# EAGLE design Luxeon Rebel Controller Board (EAGLE 6.4)
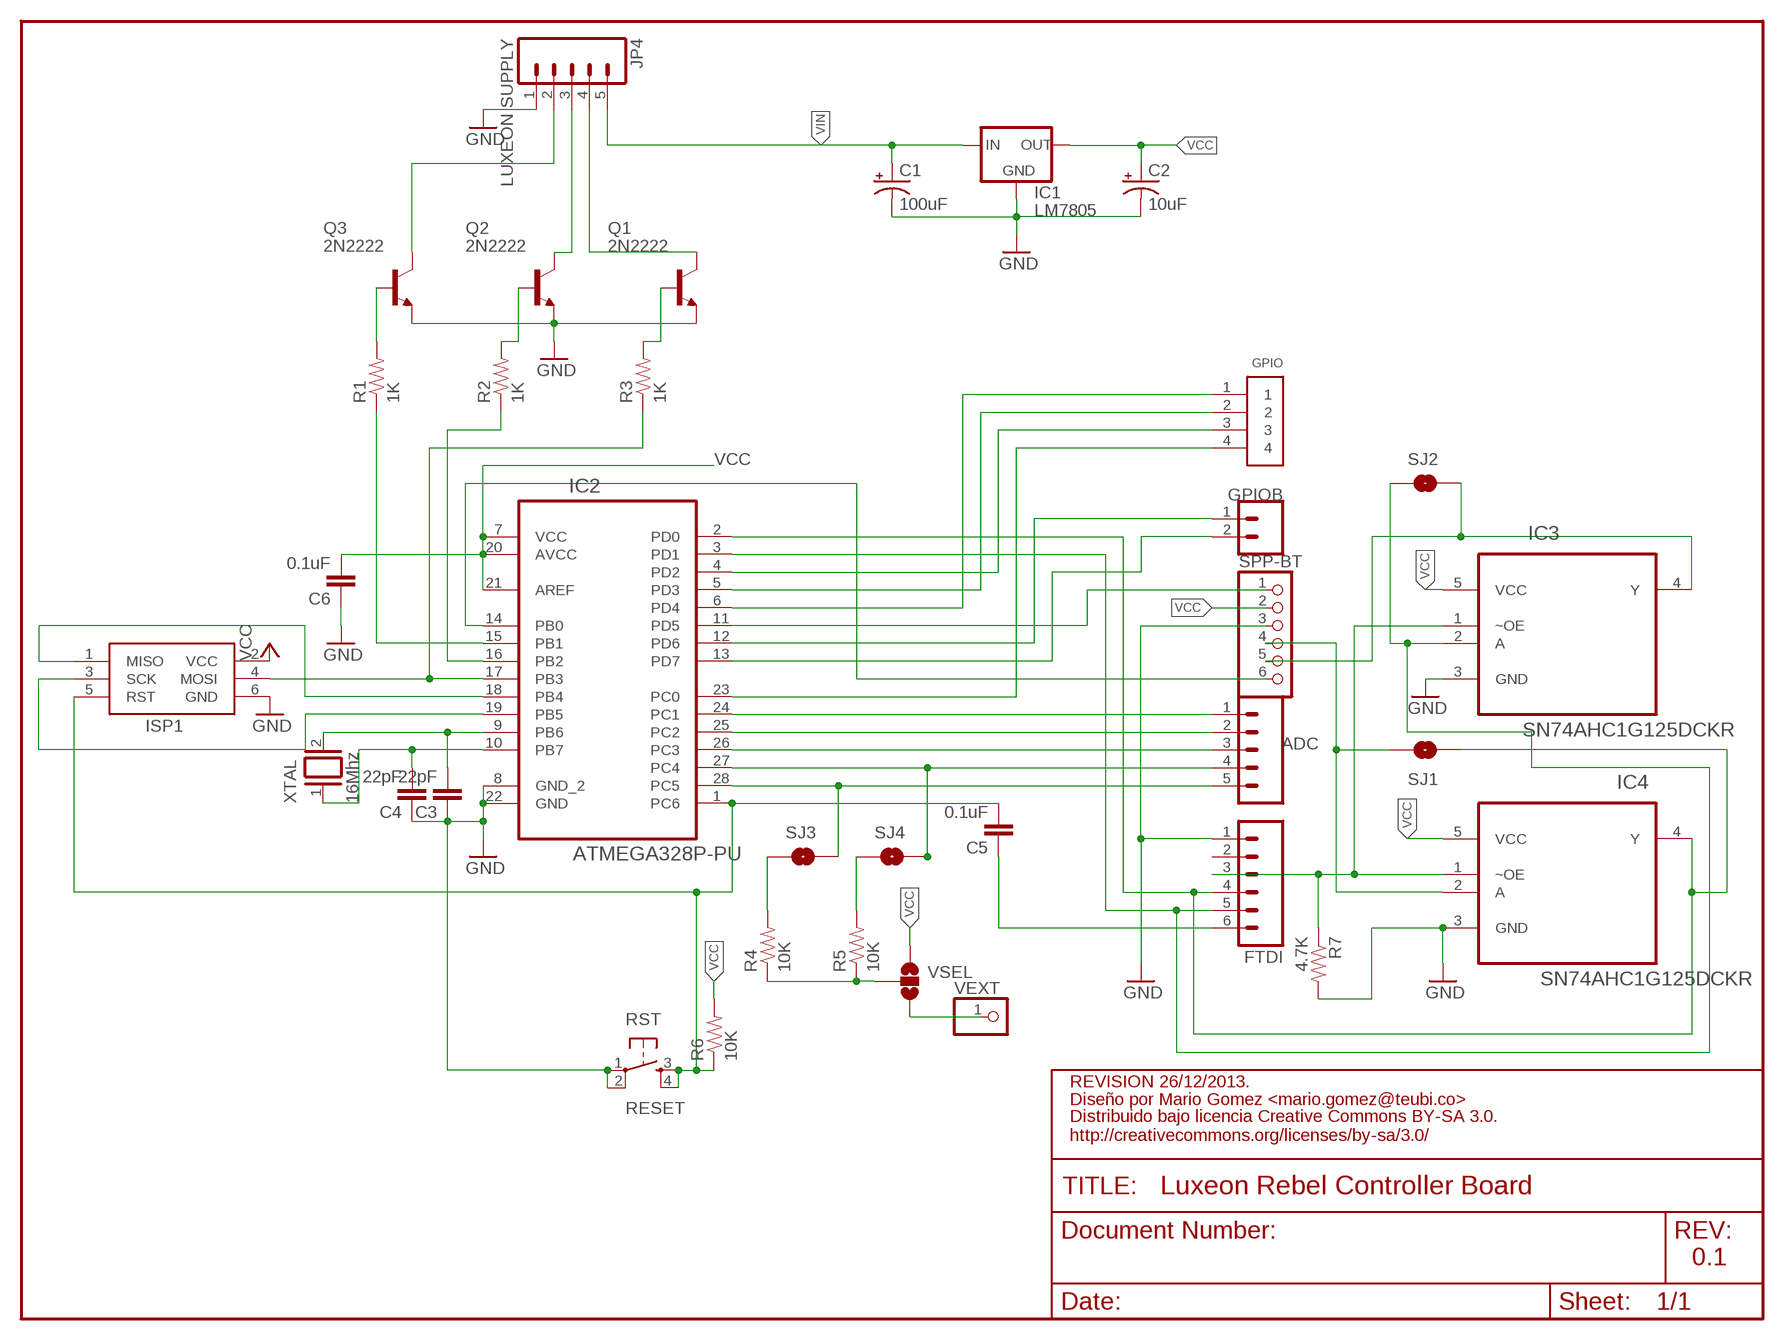
[diagram p0: schematic, sheet 1]

## Parts
ADC  M05PTH  [1X05]
C1  100uF  CAP_POLPTH1  [CPOL-RADIAL-100UF-25V]
C2  10uF  CAP_POLPTH2  [CPOL-RADIAL-10UF-25V]
C3  22pF  CAPPTH  [CAP-PTH-SMALL]
C4  22pF  CAPPTH  [CAP-PTH-SMALL]
C5  0.1uF  CAPPTH  [CAP-PTH-SMALL]
C6  0.1uF  CAPPTH  [CAP-PTH-SMALL]
FTDI  M06SIP  [1X06]
GPIO  1X4-BIG  [1X04-BIG]
GPIOB  M02PTH  [1X02]
IC1  LM7805  V_REG_78XXSIDE  [78XXL]
IC2  ATMEGA328P-PU  [DIP254P762X457-28]
IC3  SN74AHC1G125DCKR  [SOT65P210X110-5N]
IC4  SN74AHC1G125DCKR  [SOT65P210X110-5N]
ISP1  AVRISP-6  [AVRISP]
JP4  LUXEON SUPPLY  M05PTH_LONGPADS  [1X05_LONGPADS]
Q1  2N2222  [TO92-EBC-OVAL]
Q2  2N2222  [TO92-EBC-OVAL]
Q3  2N2222  [TO92-EBC-OVAL]
R1  1K  RESISTORAXIAL-0.3  [AXIAL-0.3]
R2  1K  RESISTORAXIAL-0.3  [AXIAL-0.3]
R3  1K  RESISTORAXIAL-0.3  [AXIAL-0.3]
R4  10K  RESISTORAXIAL-0.3  [AXIAL-0.3]
R5  10K  RESISTORAXIAL-0.3  [AXIAL-0.3]
R6  10K  RESISTORAXIAL-0.3  [AXIAL-0.3]
R7  4.7K  RESISTOR0603-RES  [0603-RES]
RST  RESET  TAC_SWITCHPTH  [TACTILE-PTH]
SJ1  SOLDERJUMPERNC  [SJ_2S]
SJ2  SOLDERJUMPERNC  [SJ_2S]
SJ3  SOLDERJUMPERTRACE  [SJ_2S-TRACE]
SJ4  SOLDERJUMPERTRACE  [SJ_2S-TRACE]
SPP-BT  PINHD-1X6  [1X06]
VEXT  PINHD-1X1  [1X01]
VSEL  SOLDERJUMPER_2WAY-OLDS  [SJ_3]
XTAL  16Mhz  XTAL/S  [QS]

## Nets
GND: C1.2(-) C2.2(-) C3.1 C4.1 C6.1 FTDI.1 IC1.GND IC2.8(GND_2) IC2.22(GND) IC3.3(GND) IC4.3(GND) ISP1.6(GND) JP4.1 Q1.E Q2.E Q3.E R7.2 RST.1 RST.2 SPP-BT.3
N$1: JP4.2 Q3.C
N$2: JP4.3 Q2.C
N$3: JP4.4 Q1.C
N$5: IC2.15(PB1) R1.P$1
N$6: IC2.16(PB2) R2.P$1
N$7: Q3.B R1.P$2
N$8: Q2.B R2.P$2
N$9: Q1.B R3.P$2
N$10: IC2.17(PB3) ISP1.4(MOSI) R3.P$1
N$12: C3.2 IC2.9(PB6) XTAL.2
N$13: IC2.18(PB4) ISP1.1(MISO)
N$14: ADC.5 IC2.28(PC5) SJ3.2
N$15: ADC.4 IC2.27(PC4) SJ4.2
N$16: IC4.2(A) SJ1.1 SPP-BT.4
N$17: C5.1 FTDI.6
N$18: FTDI.4 IC2.2(PD0) IC4.4(Y) SJ1.2
N$19: FTDI.3 IC3.1(~OE) IC4.1(~OE) R7.1
N$20: IC2.19(PB5) ISP1.3(SCK)
N$21: C4.2 IC2.10(PB7) XTAL.1
N$22: R4.P$2 SJ3.1
N$23: C5.2 IC2.1(PC6) ISP1.5(RST) R6.P$1 RST.3 RST.4
N$24: IC2.11(PD5) SPP-BT.1
N$25: IC2.14(PB0) SPP-BT.6
N$26: IC3.4(Y) SJ2.2 SPP-BT.5
N$27: R5.P$2 SJ4.1
N$28: GPIOB.2 IC2.13(PD7)
N$29: GPIOB.1 IC2.12(PD6)
N$30: ADC.3 IC2.26(PC3)
N$31: ADC.2 IC2.25(PC2)
N$32: ADC.1 IC2.24(PC1)
N$33: R4.P$1 R5.P$1 VSEL.2
N$34: VEXT.1 VSEL.3
N_PC0: GPIO.4 IC2.23(PC0)
N_PD1: FTDI.5 IC2.3(PD1) IC3.2(A) SJ2.1
N_PD2: GPIO.3 IC2.4(PD2)
N_PD3: GPIO.2 IC2.5(PD3)
N_PD4: GPIO.1 IC2.6(PD4)
VCC: C2.1(+) C6.2 IC1.OUT IC2.7(VCC) IC2.20(AVCC) IC2.21(AREF) IC3.5(VCC) IC4.5(VCC) ISP1.2(VCC) R6.P$2 SPP-BT.2 VSEL.1
VIN: C1.1(+) IC1.IN JP4.5
Unconnected: FTDI.2

## Notes on the sheet
- REVISION 26/12/2013.
- Diseño por Mario Gomez <mario.gomez@teubi.co>
- Distribuido bajo licencia Creative Commons BY-SA 3.0.
  http://creativecommons.org/licenses/by-sa/3.0/
- 0.1

## Library data of the parts
ADC = SparkFun-Connectors:M05: Header 5 Standard 5-pin 0.1" header. Use with straight break away headers (SKU : PRT-00116), right angle break away headers (PRT-00553), swiss pins (PRT-00743), machine pins (PRT-00117), and female headers (PRT-00115). Molex polarized connector foot print use with SKU : PRT-08230 with associated crimp pins and housings.
C1 C2 = SparkFun-Capacitors:CAP_POL: Capacitor Polarized These are standard SMD and PTH capacitors. Normally 10uF, 47uF, and 100uF in electrolytic and tantalum varieties. Always verify the external diameter of the through hole cap, it varies with capacity, voltage, and manufacturer. The EIA devices should be standard.
C3-C6 = SparkFun-Passives:CAP: Capacitor Standard 0603 ceramic capacitor, and 0.1" leaded capacitor.
FTDI = SparkFun-Connectors:M06: Header 6 Standard 6-pin 0.1" header. Use with straight break away headers (SKU : PRT-00116), right angle break away headers (PRT-00553), swiss pins (PRT-00743), machine pins (PRT-00117), and female headers (PRT-00115). Molex polarized connector foot print use with SKU : PRT-08094 with associated crimp pins and housings. NOTES ON THE VARIANTS LOCK and LOCK_LONGPADS... This footprint was designed to help hold the alignment of a through-hole component (i.e. 6-pin header) while soldering it into place. You may notice that each hole has been shifted either up or down by 0.005 of an inch from it's more standard position (which is a perfectly straight line). This slight alteration caused the pins (the squares in the middle) to touch the edges of the holes. Because they are alternating, it causes a "brace" to hold the component in place. 0.005 has proven to be the perfect amount of "off-center" position when using our standard breakaway headers. Although looks a little odd when you look at the bare footprint, once you have a header in there, the alteration is very hard to notice. Also,if you push a header all the way into place, it is covered up entirely on the bottom side. This idea of altering the position of holes to aid alignment will be further integrated into the Sparkfun Library for other footprints. It can help hold any component with 3 or more connection pins.
GPIO = adafruit:1X4: 4-pin connector
GPIOB = SparkFun-Connectors:M02: Standard 2-pin 0.1" header. Use with - straight break away headers ( PRT-00116) - right angle break away headers (PRT-00553) - swiss pins (PRT-00743) - machine pins (PRT-00117) - female headers (PRT-00115) Molex polarized connector foot print use with: PRT-08233 with associated crimp pins and housings. 2.54_SCREWTERM for use with PRT-10571. 3.5mm Screw Terminal footprints for PRT-08084 5mm Screw Terminal footprints for use with PRT-08433
IC1 = SparkFun-PowerIC:V_REG_78XX: Voltage Regulator Standard 7805 5V regulator. IGO (Input Ground Output). Spark Fun Electronics SKU : COM-00107
IC2 = Atmel_By_element14_Batch_1:ATMEGA328P-PU: 8-bit Microcontroller with In-System Programmable Flash; MPN: ATMEGA328P-PU; OC_FARNELL: 1715487; OC_NEWARK: 15R0268; PACKAGE: PDIP-28; SUPPLIER: Atmel
IC3 IC4 = NewArk-Downloads:SN74AHC1G125DCKR: Single Bus Buffer Gate With 3-State Output; MPN: SN74AHC1G125DCKR; OC_FARNELL: 1287409; OC_NEWARK: 76C1732; PACKAGE: SC70-5; SUPPLIER: Texas Instruments
ISP1 = adafruit:AVRISP: AVR ISP HEADER Standard 6 pin header for AVR programming
JP4 = SparkFun:M05: Header 5 Standard 5-pin 0.1" header. Use with straight break away headers (SKU : PRT-00116), right angle break away headers (PRT-00553), swiss pins (PRT-00743), machine pins (PRT-00117), and female headers (PRT-00115). Molex polarized connector foot print use with SKU : PRT-08230 with associated crimp pins and housings.
Q1-Q3 = adafruit:2N2222: NPN TRANSISTOR Big oval pads
R1-R7 = SparkFun-Passives:RESISTOR: Resistor Basic schematic elements and footprints for 0603, 1206, and PTH resistors.
RST = SparkFun-Electromechanical:TAC_SWITCH: Momentary Switch Button commonly used for reset or general input. Spark Fun Electronics SKU : COM-00097 SMT- SWCH-08247
SJ1-SJ4 = SparkFun-Passives:SOLDERJUMPER: Solder Jumper Standard SMD solder jumper. Used to automate production. Two varients : Normally Open and Normally Closed are the same, but have different paste layers. NC will have a large amount of paste and should jumper during reflow.
SPP-BT = adafruit:PINHD-1X6: PIN HEADER
VEXT = pinhead:PINHD-1X1: PIN HEADER
VSEL = SparkFun-Passives:SOLDERJUMPER_2WAY-OLD: Solder Jumper 2 way solder jumper
XTAL = special:XTAL/S: CRYSTAL

## Board
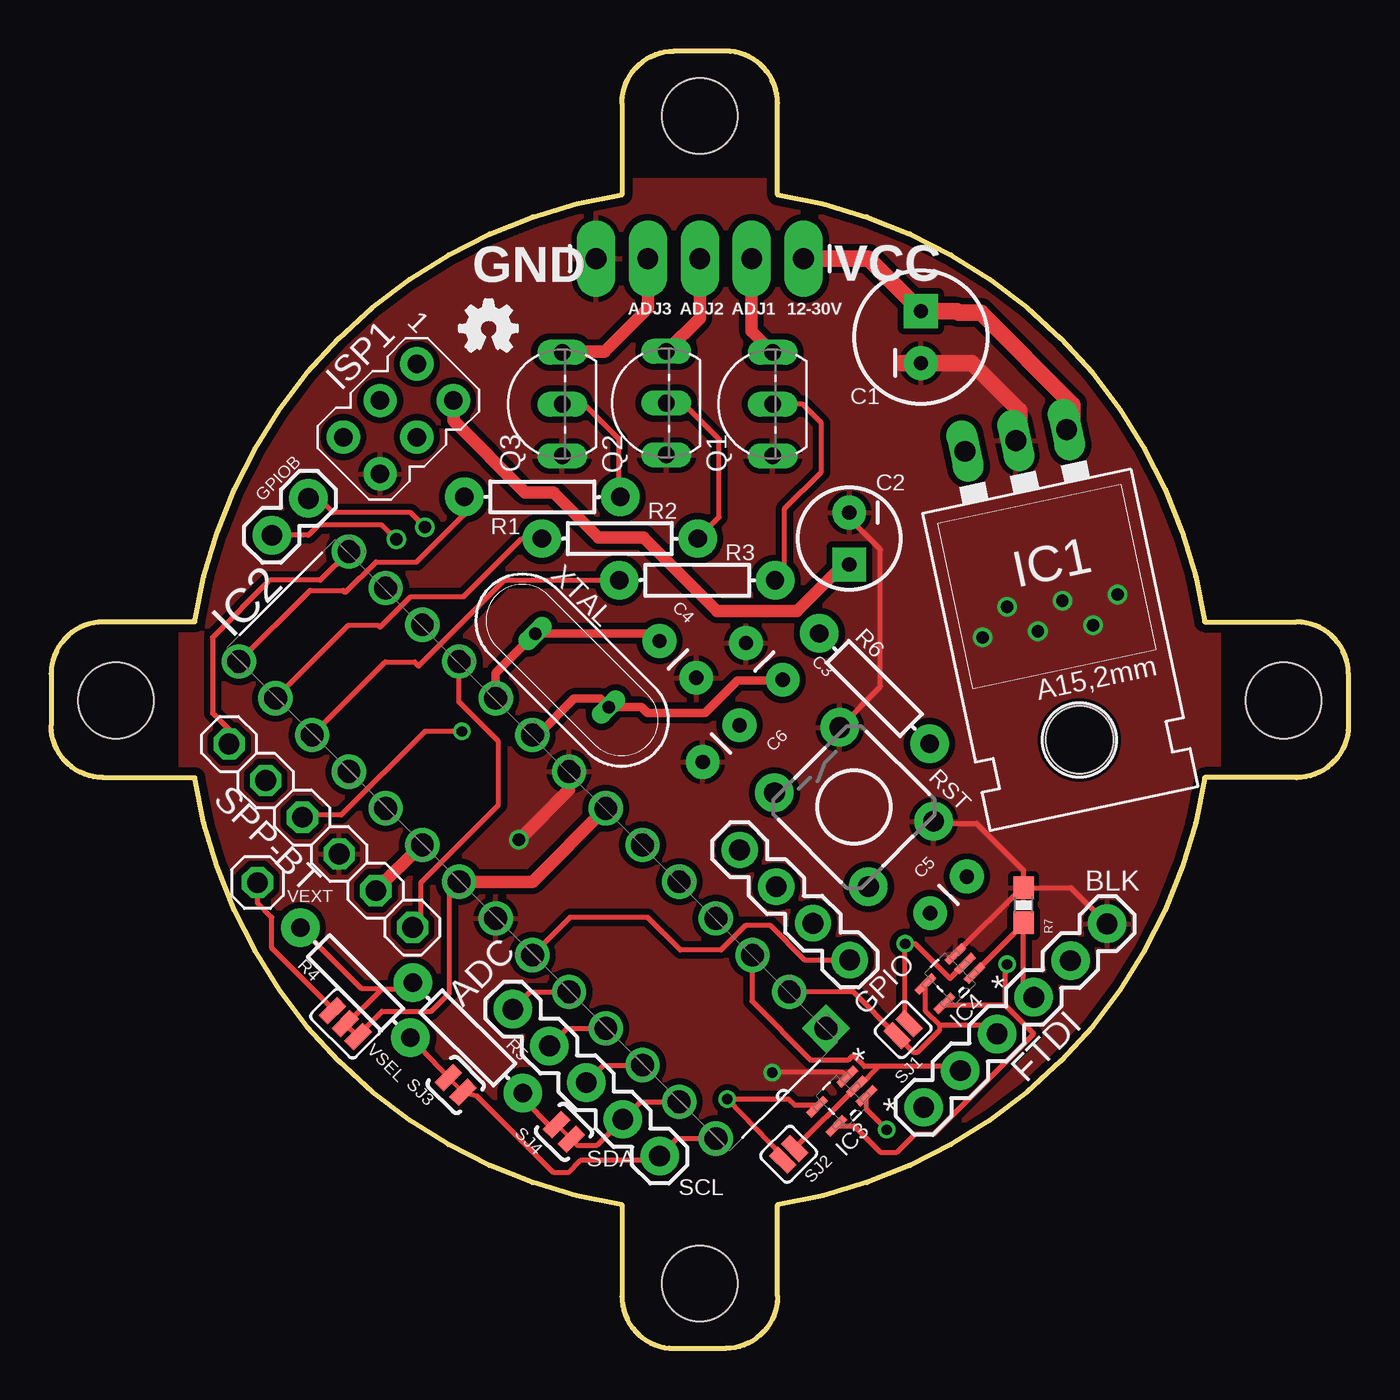
[diagram p1: board, top side]
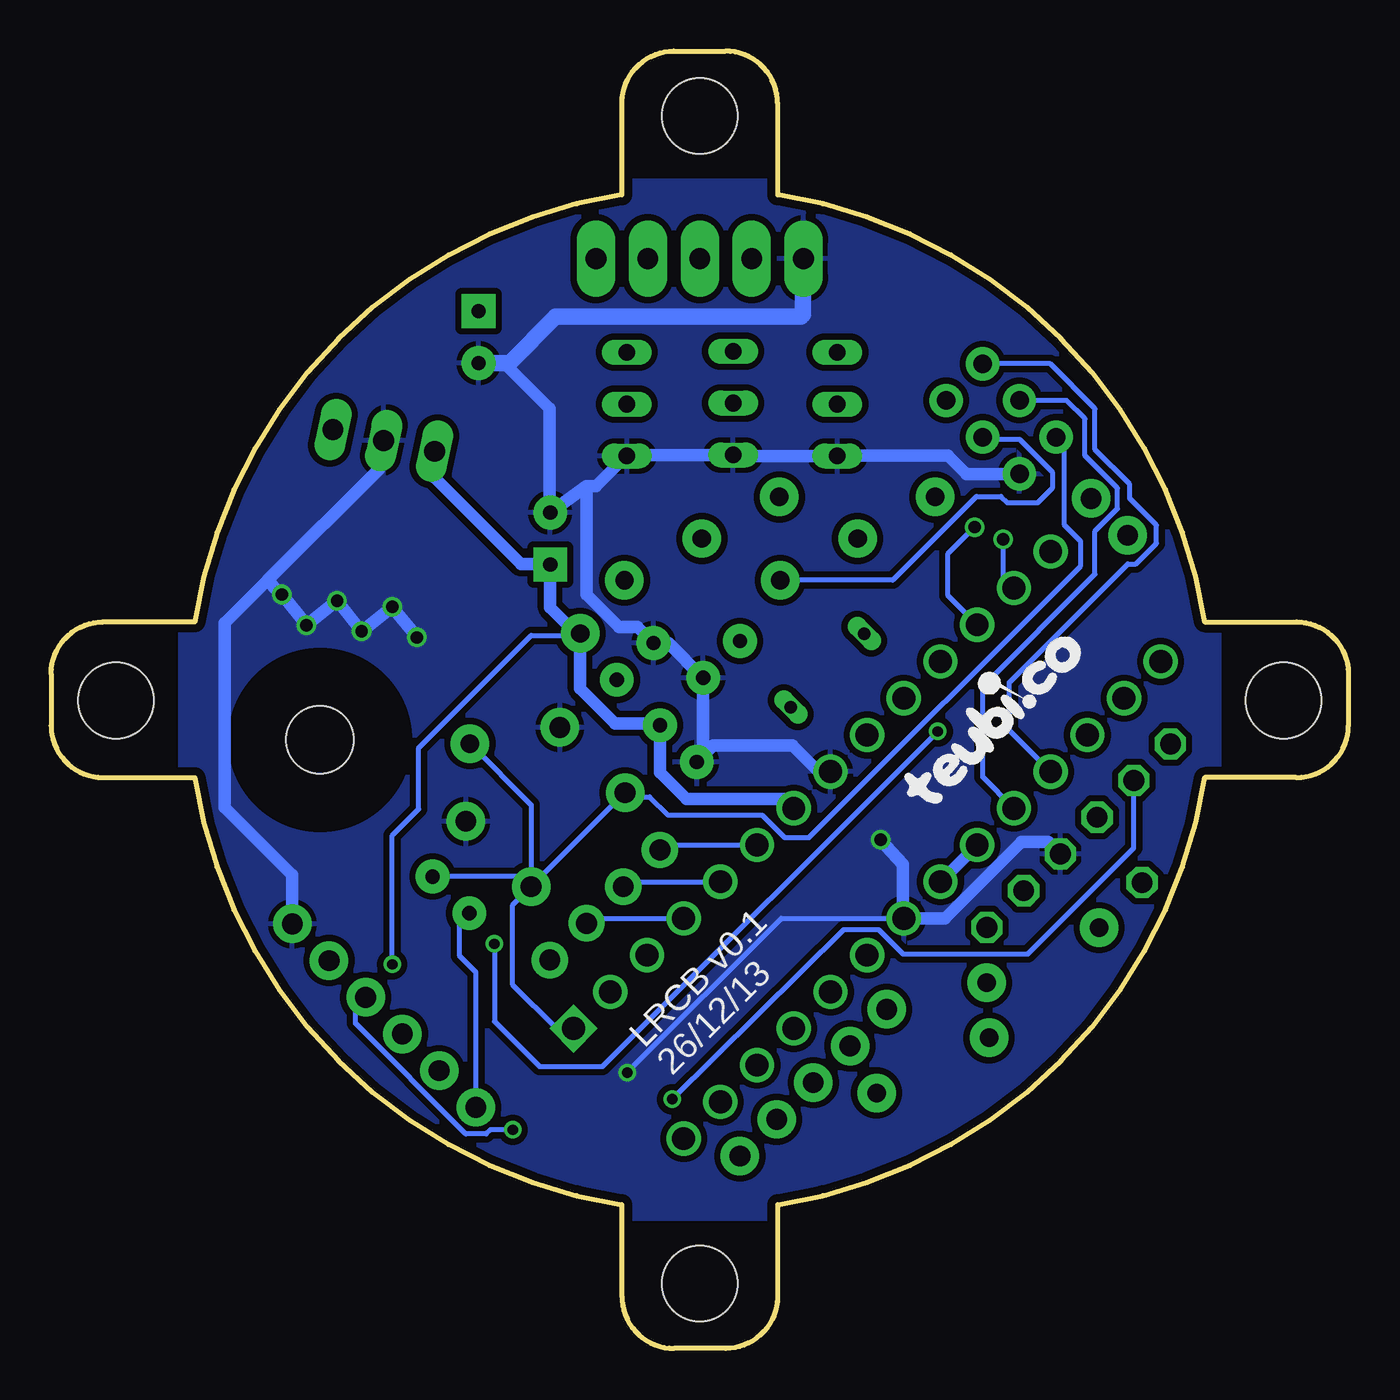
[diagram p2: board, bottom side, seen from below]

Size 63.5 x 63.5 mm. Coordinates in mm from the lower left corner, seen from the top.
Outline: 35.56,56.46 35.56,60.96 arc90 33.02,63.5 30.48,63.5 arc90 27.94,60.96 27.94,56.46 arc72 7.04,35.56 2.54,35.56 arc90 0,33.02 0,30.48 arc90 2.54,27.94 7.04,27.94 arc72 27.94,7.04 27.94,2.54 arc90 30.48,0 33.02,0 arc90 35.56,2.54 35.56,7.04 arc72 56.46,27.94 60.96,27.94 arc90 63.5,30.48 63.5,33.02 arc90 60.96,35.56 56.46,35.56 arc72 35.56,56.46
Copper layers (1*16): Top 0.0356mm / dielectric 1.5011mm / Bottom 0.0356mm
Design rules "LaenPCBOrder": minimum track width 6mil, minimum drill 13mil, track to track 6mil, track to pad 6mil, pad to pad 6mil, via to via 6mil, smd to smd 6mil, copper to edge 15mil, drill to drill 6mil, minimum pad ring 7mil, minimum via ring 7mil, stop-mask expansion 3mil, vias tented up to drill 0mil, thermal gap 10mil
Holes 3.7 mm at 31.75,60.33 60.33,31.71 3.17,31.71 31.75,3.17

### Footprints (pad centres in the part's own frame; a part is rotated, then mirrored left to right if it is on the bottom)
1X05 = drill 1.016 pad 1.88: 1 0,0; 2 2.54,0; 3 5.08,0; 4 7.62,0; 5 10.16,0
CPOL-RADIAL-100UF-25V = drill 0.7 pad 1.651 square: 1 1.27,0 | drill 0.7 pad 1.651: 2 -1.27,0
CPOL-RADIAL-10UF-25V = drill 0.7 pad 1.651 square: 1 1.27,0 | drill 0.7 pad 1.651: 2 -1.27,0
CAP-PTH-SMALL = drill 0.7 pad 1.651: 1 0,0; 2 2.54,0
1X06 = drill 1.016 pad 1.88: 1 0,0; 2 2.54,0; 3 5.08,0; 4 7.62,0; 5 10.16,0; 6 12.7,0
1X04-BIG = drill 1.016 pad 1.778: 1 0,0; 2 2.54,0; 3 5.08,0; 4 7.62,0
1X02 = drill 1.016 pad 1.88: 1 0,0; 2 2.54,0
78XXL = drill 1.016 long: GND 0,-3.81; IN -2.54,-3.81; OUT 2.54,-3.81 | hole 3.302: 0,11.176
DIP254P762X457-28 = drill 1.118 square: 1 -7.62,33.02 | drill 1.118: 2 -7.62,30.48; 3 -7.62,27.94; 4 -7.62,25.4; 5 -7.62,22.86; 6 -7.62,20.32; 7 -7.62,17.78; 8 -7.62,15.24; 9 -7.62,12.7; 10 -7.62,10.16; 11 -7.62,7.62; 12 -7.62,5.08; 13 -7.62,2.54; 14 -7.62,0; 15 0,0; 16 0,2.54; 17 0,5.08; 18 0,7.62; 19 0,10.16; 20 0,12.7; 21 0,15.24; 22 0,17.78; 23 0,20.32; 24 0,22.86; 25 0,25.4; 26 0,27.94; 27 0,30.48; 28 0,33.02
SOT65P210X110-5N = smd 1.168 x 0.356: 1 -1.041,0.66; 2 -1.041,0; 3 -1.041,-0.66; 4 1.041,-0.66; 5 1.041,0.66
AVRISP = drill 0.9 pad 1.626: 1 -1.27,2.54; 2 1.27,2.54; 3 -1.27,0; 4 1.27,0; 5 -1.27,-2.54; 6 1.27,-2.54
1X05_LONGPADS = drill 1.016 pad 1.88 long: 1 0,0; 2 2.54,0; 3 5.08,0; 4 7.62,0; 5 10.16,0
TO92-EBC-OVAL = drill 0.813 long: B 0,-1.27; C 2.54,-1.27; E -2.54,-1.27
AXIAL-0.3 = drill 0.9 pad 1.88: P$1 -3.81,0; P$2 3.81,0
0603-RES = smd 1.1 x 1: 1 -0.85,0; 2 0.85,0
TACTILE-PTH = drill 1.016 pad 1.88: 1 -3.251,2.261; 2 3.251,2.261; 3 -3.251,-2.261; 4 3.251,-2.261
SJ_2S = smd 0.635 x 1.27: 1 -0.412,0; 2 0.412,0
SJ_2S-TRACE = smd 0.635 x 1.27: 1 -0.508,0; 2 0.508,0
1X06' = drill 1.016 octagon: 1 -6.35,0; 2 -3.81,0; 3 -1.27,0; 4 1.27,0; 5 3.81,0; 6 6.35,0
1X01 = drill 1.016 octagon: 1 0,0
SJ_3 = smd 0.635 x 1.27: 1 -0.889,0; 2 0,0; 3 0.889,0
QS = drill 0.61 long: 1 -2.54,0; 2 2.54,0

### Placement (x,y rotation side)
ADC  22.6,16.6 315 top
C1  42.58,49.5 90 top
C2  39.07,39.64 270 top
C3  34.01,34.52 315 top
C4  31.58,32.82 135 top
C5  43.03,21.3 45 top
C6  31.9,28.7 45 top
FTDI  51.69,20.78 225 top
GPIO  33.7,24.4 315 top
GPIOB  12.6,41.6 225 top
IC1  48.01,40.71 192 top
IC2  9.19,33.62 225 top
IC3  38.7,12.1 225 top
IC4  44,18.1 225 top
ISP1  17,45.5 315 top
JP4  26.67,53.34 0 top
Q1  34.05,46.22 90 top
Q2  28.85,46.27 90 top
Q3  23.75,46.22 90 top
R1  24.04,41.68 0 top
R2  27.84,39.64 0 top
R3  31.62,37.6 0 top
R4  14.9,17.9 315 top
R5  20.4,15.2 315 top
R6  40.3,32.3 135 top
R7  47.6,21.7 90 top
RST  39.3,26.5 315 top
SJ1  41.7,15.6 225 top
SJ2  36.1,9.5 225 top
SJ3  19.8,12.9 315 top
SJ4  25.1,10.6 315 top
SPP-BT  [1X06']  13.2,25.1 135 top
U$1  [LOGOVECTOR2]  17.7,31.1 45 bottom
U$2  [OSHW_FILLX100_NOTEXT]  20,48.8 0 top
VEXT  10.1,22.8 0 top
VSEL  14.4,15.9 135 top
XTAL  25.49,33.19 315 top

### Tracks (layer width: path | path; a pad name or v marks a point on that pad's centre or on a via)
GND  (via drill 0.5, 0.6)
  Top 0.254: R7.2 49.92,22.55 FTDI.1 | RST.2 43.1,25.7 45.3,25.7 47.6,23.4 R7.2 | RST.1 40.6,32.4 40.6,39.1 39.07,40.63 C2.2 | IC3.3 38.77,13.5 v35.3,13.5 | IC4.3 47.52,22.55 R7.2
  Top 0.61: 25.35,28.15 IC2.8 25.35,27.35 v22.9,24.9
  Top 0.813: IC1.GND 47.4,44.81 47.4,45.9 45.07,48.23 C1.2 41.63,48.23
  Bottom 0.254: v35.3,13.5 27.75,21.05 IC2.22 | v45.6,34.8 v45.59,34.81 45.59,34.81 | 52.2,36.8 51,35.6 v51,35.4
  Bottom 0.406: Q1.E 35.07,43.73 | Q2.E 30.07,43.68
  Bottom 0.61: IC2.8 25.93,28.23 27.2,29.5 31.1,29.5 C6.1 31.58,29.02 C4.1 33.28,34.52 C3.1 34.79,35.3 35.7,35.3 37.3,36.9 37.3,42.21 | Q1.E 35.24,43.8 36.83,42.21 37.3,42.21 | 35.07,43.73 Q2.E | 30.07,43.68 Q3.E 25,43.7 19.6,43.7 18.71,42.81 ISP1.6 | 37.3,42.21 C2.2 39.1,42.24 39.1,46 41.33,48.23 C1.2 | v22.9,24.9 21.8,23.7 21.8,21.1 IC2.22 19.75,21.05 16,24.8 14.7,24.8 SPP-BT.3 | 52.9,37.6 55,35.5 55,26.49 51.69,23.18 FTDI.1 | 52.9,37.6 47.45,43.05 IC1.GND | 52.2,36.8 52.9,37.6 | 45.5,34.7 45.59,34.81 v46.8,36.3 v48.3,35.1 v49.5,36.6 v51,35.4 v52.2,36.9
  Bottom 0.813: JP4.1 26.7,53.31 26.7,50.6 26.8,50.5 38.8,50.5 41.07,48.23 C1.2
  pour Bottom (isolate 0.305): 6.35,6.35 57.15,6.35 57.15,57.15 6.35,57.15
  pour Top (isolate 0.305): 6.35,6.35 57.15,6.35 57.15,57.15 6.35,57.15
N$1
  Top 0.61: Q3.C 25.06,48.8 27.1,48.8 29.21,50.91 JP4.2
N$2
  Top 0.61: Q2.C 31.75,50.44 JP4.3
N$3
  Top 0.61: Q1.C 34.29,49.79 JP4.4
N$5
  Top 0.254: IC2.15 12.67,37.1 14.3,37.1 14.4,37 15.9,38.5 17.9,38.5 20.23,40.83 R1.P$1
N$6
  Top 0.254: IC2.16 14.56,35.4 16,35.4 16.1,35.3 17.6,36.8 20.2,36.8 23.04,39.64 R2.P$1
N$7
  Top 0.254: R1.P$2 27.8,41.73 27.8,44.5 26.08,46.22 Q3.B
N$8
  Top 0.254: R2.P$2 32.7,40.69 32.7,44.5 30.93,46.27 Q2.B
N$9
  Top 0.254: R3.P$2 35.9,38.06 35.9,41.1 37.7,42.9 37.7,45.3 36.78,46.22 Q1.B
N$10
  Top 0.254: IC2.17 16.35,33.6 17.8,33.6 18,33.4 22.2,37.6 R3.P$1
  Bottom 0.254: ISP1.4 17.8,44.5 16.1,44.5 14.5,42.9 14.5,42.1 15.2,41.4 16.7,41.4 17,41.7 18.2,41.7 22.3,37.6 R3.P$1
N$12
  Top 0.406: C3.2 35.78,32.7 33.6,32.7 32,31.1 29.2,31.1 28.91,31.39 XTAL.2 26.88,31.8 25.6,31.8 23.83,30.03 IC2.9
N$13
  Bottom 0.254: IC2.18 16.6,30.25 16.6,32.6 10.8,38.4 10.4,38.4 9.4,39.4 9.4,40.3 10.7,41.6 10.7,42.3 12.4,44 12.4,46 14.59,48.19 ISP1.1
N$14
  Top 0.254: IC2.28 30.64,10.27 ADC.5 29.57,9.2 25.9,9.2 25.3,8.6 24.6,8.6 20.86,12.34 SJ3.2
N$15
  Top 0.254: IC2.27 28.84,12.07 ADC.4 26.72,9.94 25.76,9.94 SJ4.2
N$16  (via drill 0.5)
  Top 0.254: v20.1,30.2 18.3,30.2 14.2,26.1 12.4,26.1 SPP-BT.4 | IC4.2 44,18.1 42.3,19.8 v41.8,19.8 41.8,16.08 SJ1.1
  Bottom 0.254: v41.8,19.8 41.8,16 39.6,13.8 36.5,13.8 v20.1,30.2
N$17
  Bottom 0.254: FTDI.6 42.71,18.41 43.5,19.2 43.5,20.83 C5.1
N$18
  Top 0.254: IC2.2 39.27,17.46 SJ1.2 42.22,14.5 42.4,14.5 43.5,15.6 43.5,15.8 | 43.5,15.8 42.8,16.5 IC4.4 | FTDI.4 45.89,15.8 43.5,15.8
N$19  (via drill 0.5)
  Top 0.254: FTDI.3 47.6,17.69 R7.1 47.6,20.77 IC4.1 | v40.9,10.7 39.9,11.7 IC3.1
  Bottom 0.254: v40.9,10.7 42,10.7 42.2,10.5 43.2,10.5 48.6,15.9 48.6,16.69 FTDI.3
N$20
  Bottom 0.254: IC2.19 17.9,27.96 17.9,32.4 12.4,37.9 12.4,40 11.3,41.1 11.3,42.1 12.9,43.7 12.9,45.5 13.8,46.4 ISP1.3
N$21
  Top 0.406: C4.2 29.42,34.99 XTAL.1 21.76,33.05 IC2.10
N$22
  Top 0.254: R4.P$2 SJ3.1
N$23
  Bottom 0.254: IC2.1 38.76,15.66 40.9,17.8 40.9,21.7 RST.4 | RST.4 40.49,23.1 C5.2 | RST.4 RST.3 35.2,27 34.2,27 33.3,26.1 28.7,26.1 27.6,25 26.4,25 13.1,38.3 13.1,39.5 13.9,40.3 13.9,44.2 ISP1.5 | R6.P$1 40,26.61 RST.4
N$24
  Top 0.254: SPP-BT.1 18.1,21.02 18.1,22.8 21.9,26.6 21.9,29.7 19.97,31.63 IC2.11
N$25
  Top 0.254: IC2.14 13.17,37.6 10.7,37.6 7.9,34.8 7.9,31.1 8.71,30.29 SPP-BT.6
N$26  (via drill 0.5)
  Top 0.254: IC3.4 37.43,11.9 36.4,11.9 36.1,12.2 v33.1,12.2 35.81,9.39 SJ2.2
  Bottom 0.254: v33.1,12.2 24.7,20.5 23,20.5 21.8,19.3 15.7,19.3 10.51,24.49 SPP-BT.5
N$27
  Top 0.254: SJ4.1 24.54,10.76 23.09,12.21 R5.P$2
N$28  (via drill 0.6)
  Top 0.254: v16.9,39.6 16.2,40.3 13.1,40.3 12.6,39.8 GPIOB.2
  Bottom 0.254: IC2.13 16.9,37.74 v16.9,39.6
N$29  (via drill 0.6)
  Top 0.254: v18.3,40.2 17.6,40.9 13.8,40.9 13.1,41.6 GPIOB.1
  Bottom 0.254: IC2.12 19.6,36.85 19.6,38.9 v18.3,40.2
N$30
  Top 0.254: ADC.3 27.05,13.86 IC2.26
N$31
  Top 0.254: ADC.2 25.25,15.66 IC2.25
N$32
  Top 0.254: ADC.1 23.46,17.46 IC2.24
N$33
  Top 0.254: VSEL.2 14.4,15.8 16.2,17.6 | 16.2,17.6 17.41,17.6 R5.P$1 | 16.2,17.6 15.2,17.6 R4.P$1
N$34
  Top 0.254: VSEL.3 13.67,16.73 10.8,19.6 10.8,21.1 10.1,21.8 VEXT.1
N$35
  Top 0.254: 14.6,15.7 14.8,15.5
N_PC0
  Top 0.254: GPIO.4 39.08,19 36.9,19 35.2,20.7 34,20.7 32.8,19.5 30.8,19.5 29.2,21.1 25.4,21.1 IC2.23
N_PD1
  Top 0.254: SJ2.1 IC3.2 39.54,12.84 40.5,13.8 | FTDI.5 44.3,13.8 40.5,13.8 | IC2.3 34.3,19.22 34.3,17 37.2,14.1 39,14.1 39.2,14.3 39.3,14.3 39.8,13.8 40.5,13.8
N_PD2
  Bottom 0.254: GPIO.3 37.05,21.05 IC2.4
N_PD3
  Bottom 0.254: GPIO.2 35.26,22.84 IC2.5
N_PD4
  Bottom 0.254: GPIO.1 33.46,24.64 IC2.6
VCC  (via drill 0.5)
  Top 0.254: 46.7,16.8 48.1,15.4 43.2,10.5 42.3,10.5 41.4,9.6 40.6,9.6 39.3,10.9 IC3.5 | 46.7,16.8 43.7,16.8 43.73,16.83 IC4.5 | 46.7,16.8 46.7,18.7 v46.8,18.8 | VSEL.1 14.93,15.23 16.2,16.5 18.6,16.5 19.5,17.4 19.5,22.38 IC2.21
  Top 0.61: IC2.7 23.56,22.84 IC2.21 | C2.1 39.04,38.4 38.8,38.4 36.5,36.1 | 36.5,36.1 32.6,36.1 29,39.7 26.8,39.7 24.6,41.9 23.2,41.9 19.69,45.41 ISP1.2 | 36.5,36.1 | SPP-BT.2 18.13,24.64 IC2.20
  Bottom 0.254: v46.8,18.8 46.8,25.1 45.5,26.4 45.5,29.4 40,34.9 37.7,34.9
  Bottom 0.61: IC2.20 IC2.21 | IC2.7 27.61,26.9 32.4,26.9 33.69,28.19 C6.2 33.79,30.6 35.9,30.6 37.61,32.31 R6.P$2 37.65,34.95 37.75,34.95 | IC1.OUT 44.73,42.63 40.5,38.4 39.1,38.4 C2.1 39.07,36.27 37.75,34.95 | 37.7,34.9 37.75,34.95
VIN
  Top 0.813: IC1.IN 50,45.26 50,46.2 45.5,50.7 44.4,50.7 44.33,50.77 C1.1 40.01,53.34 JP4.5

### Text on the board
tPlace: GND | VCC | ADJ3 | ADJ2 | ADJ1 | 12-30V | SDA | SCL
tNames: BLK
bNames: LRCB v0.1 / 26/12/13